# EAGLE design SpaceInvaders-v30 (EAGLE 8.0.1)
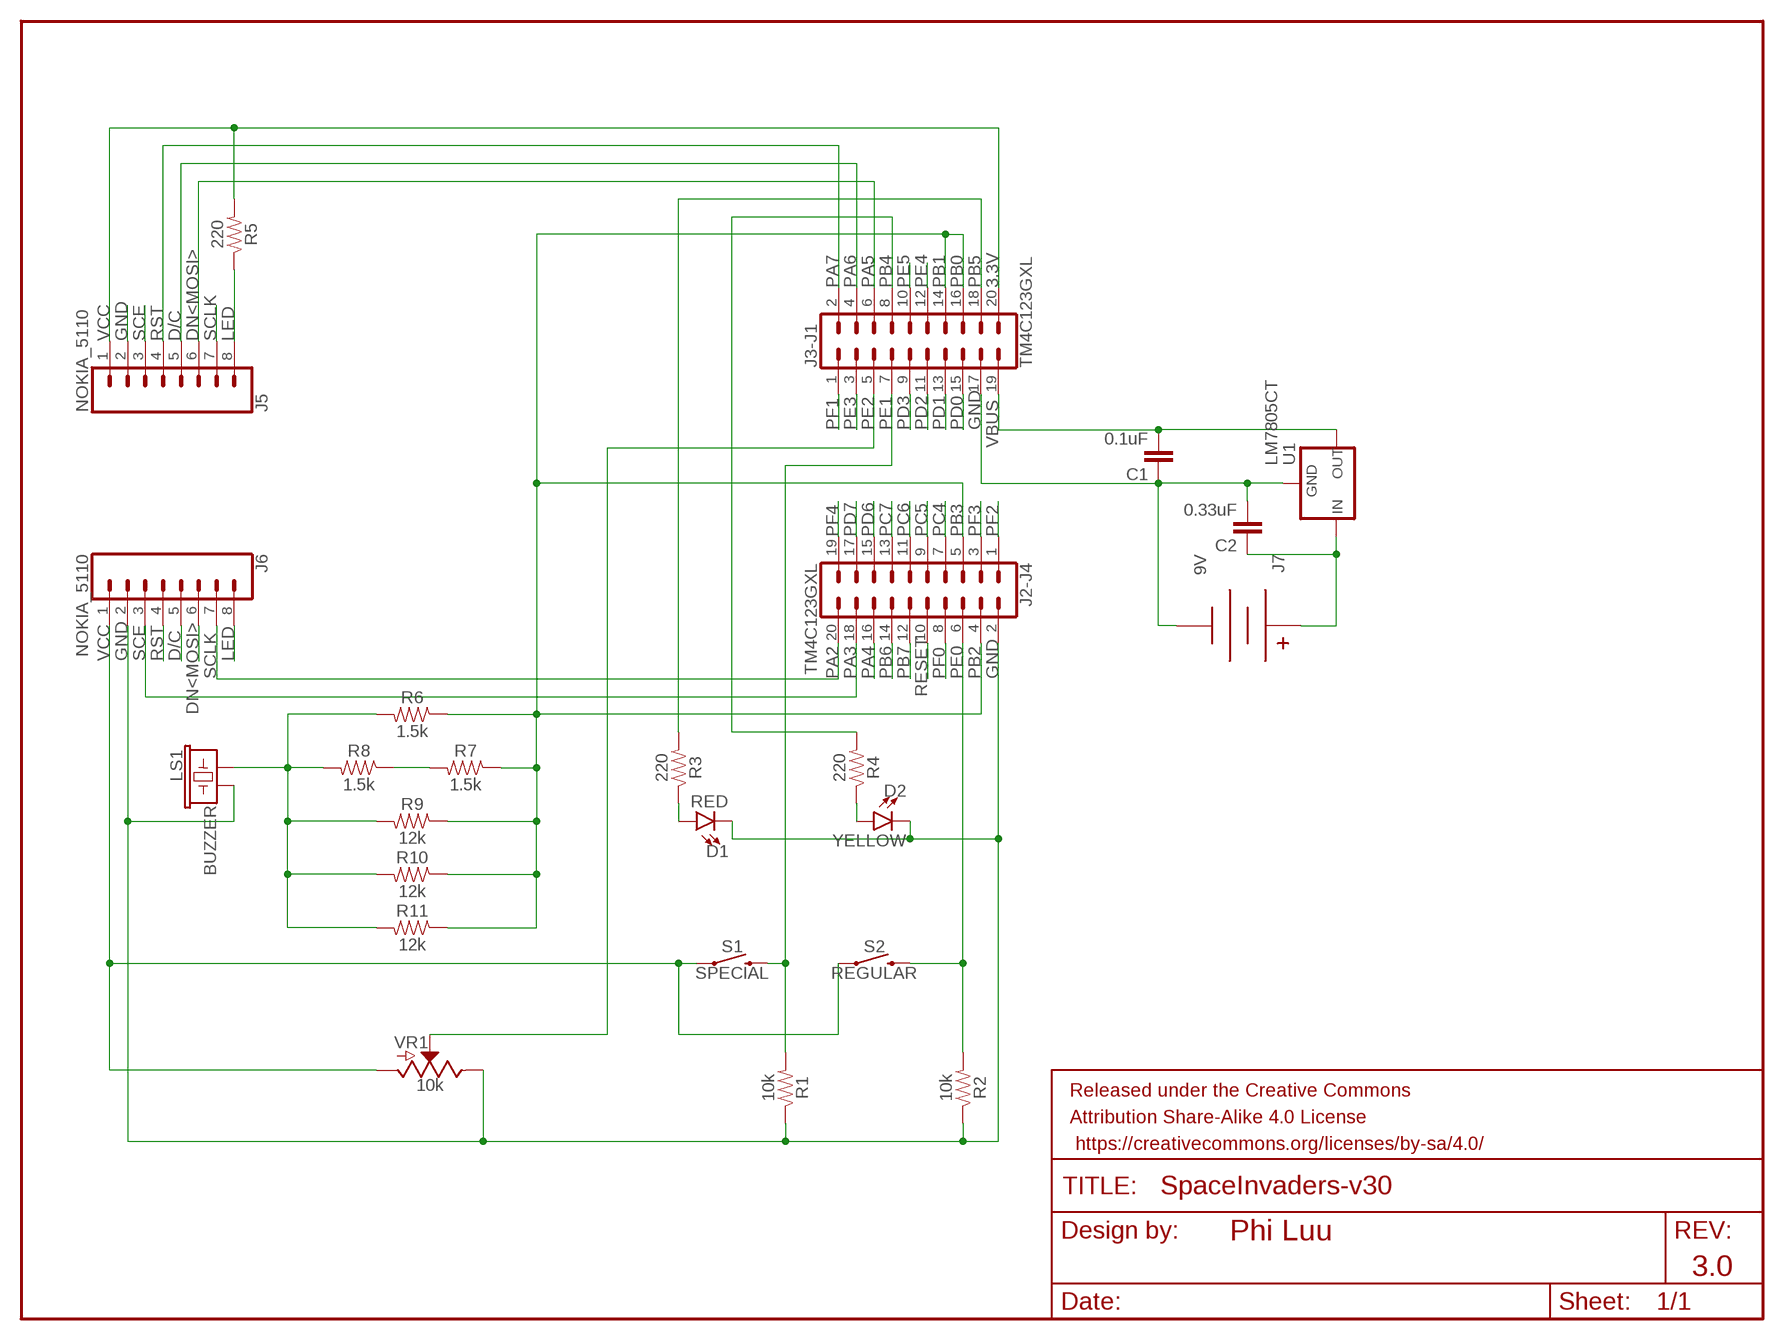
[diagram p0: schematic, sheet 1]

## Parts
C1  0.1uF  0.1UF-KIT-EZ-50V-20%  [CAP-PTH-SMALL-KIT]
C2  0.33uF  0.1UF-KIT-EZ-50V-20%  [CAP-PTH-SMALL-KIT]
D1  RED  LED5MM  [LED_5MM]
D2  YELLOW  LED5MM  [LED_5MM]
FRAME1  FRAME-LETTER  [CREATIVE_COMMONS]
J2-J4  TM4C123GXL  CONN_10X2  [2X10]
J3-J1  TM4C123GXL  CONN_10X2  [2X10]
J5  NOKIA_5110  CONN_08"  [1X08]
J6  NOKIA_5110  CONN_08"  [1X08]
J7  9V  BC9VPC  [BC9VPC]
LS1  BUZZER  BUZZER-PTH  [BUZZER-12MM]
R1  10k  10KOHM-HORIZ-1/4W-5%  [AXIAL-0.3]
R2  10k  10KOHM-HORIZ-1/4W-5%  [AXIAL-0.3]
R3  220  1KOHM-HORIZ-1/4W-5%  [AXIAL-0.3]
R4  220  1KOHM-HORIZ-1/4W-5%  [AXIAL-0.3]
R5  220  1KOHM-HORIZ-1/4W-5%  [AXIAL-0.3]
R6  1.5k  1KOHM-HORIZ-1/4W-5%  [AXIAL-0.3]
R7  1.5k  1KOHM-HORIZ-1/4W-5%  [AXIAL-0.3]
R8  1.5k  1KOHM-HORIZ-1/4W-5%  [AXIAL-0.3]
R9  12k  1KOHM-HORIZ-1/4W-5%  [AXIAL-0.3]
R10  12k  1KOHM-HORIZ-1/4W-5%  [AXIAL-0.3]
R11  12k  1KOHM-HORIZ-1/4W-5%  [AXIAL-0.3]
S1  SPECIAL  MOMENTARY-SWITCH-SPST-PTH-6.0MM  [TACTILE_SWITCH_PTH_6.0MM]
S2  REGULAR  MOMENTARY-SWITCH-SPST-PTH-6.0MM  [TACTILE_SWITCH_PTH_6.0MM]
U1  LM7805CT  V_REG_78XX-TO-220  [TO-220-ALT]
VR1  10k  POTENTIOMETER_SLIDE-30MM-1/10W-20%  [SLIDER-MEDIUM]

## Nets
3.3V [power]: J3-J1.20 J5.1 J6.1 R5.P$2 S1.1 S2.1 VR1.BOTTOM(A)
9V [power]: C2.1 J7.V+ U1.IN
DAC: J2-J4.4 J2-J4.5 J3-J1.14 J3-J1.16 R6.P$1 R7.P$1 R9.P$1 R10.P$1 R11.P$1
DAC_OUT: LS1.+ R6.P$2 R8.P$2 R9.P$2 R10.P$2 R11.P$2
GND: C1.1 C2.2 D1.K(C) D2.K(C) J2-J4.2 J3-J1.17 J5.2 J6.2 J7.V- LS1.- R1.P$1 R2.P$1 U1.GND VR1.TOP(E)
LED: J5.8 J6.8 R5.P$1
LLED: D1.A R3.P$1
N$1: R7.P$2 R8.P$1
PA2: J2-J4.20 J5.7 J6.7
PA3: J2-J4.18 J5.3 J6.3
PA4: J2-J4.16
PA5: J3-J1.6 J5.6 J6.6
PA6: J3-J1.4 J5.5 J6.5
PA7: J3-J1.2 J5.4 J6.4
PB4: J3-J1.8 R4.P$2
PB5: J3-J1.18 R3.P$2
PB6: J2-J4.14
PB7: J2-J4.12
PC4: J2-J4.7
PC5: J2-J4.9
PC6: J2-J4.11
PC7: J2-J4.13
PD0: J3-J1.15
PD1: J3-J1.13
PD2: J3-J1.11
PD3: J3-J1.9
PD6: J2-J4.15
PD7: J2-J4.17
PE0: J2-J4.6 R2.P$2 S2.3
PE1: J3-J1.7 R1.P$2 S1.3
PE2: J3-J1.5 VR1.WIPER(S)
PE3: J3-J1.3
PE4: J3-J1.12
PE5: J3-J1.10
PF0: J2-J4.8
PF1: J3-J1.1
PF2: J2-J4.1
PF3: J2-J4.3
PF4: J2-J4.19
RESET: J2-J4.10
RLED: D2.A R4.P$1
VBUS [power]: C1.2 J3-J1.19 U1.OUT

## Notes on the sheet
- PB1 | PB0
- VCC | SCE | RST | D/C | DN<MOSI> | SCLK
- PB3
- VCC | SCE | RST | D/C
- SCLK | PB2
- DN<MOSI>
- Phi Luu
- 3.0

## Library data of the parts
C1 = SparkFun-Capacitors:0.1UF: 0.1µF ceramic capacitors A capacitor is a passive two-terminal electrical component used to store electrical energy temporarily in an electric field.; PROD_ID: CAP-08370
C2 = SparkFun-Capacitors:0.1UF: 0.1µF ceramic capacitors A capacitor is a passive two-terminal electrical component used to store electrical energy temporarily in an electric field.; PROD_ID: CAP-08370; VALUE: 0.1uF
D1 D2 = SparkFun-LED:LED: LED (Generic) Standard schematic elements and footprints for 5mm, 3mm, 1206, and 0603 sized LEDs. Generic LEDs with no color specified.
FRAME1 = SparkFun-Aesthetics:FRAME-LETTER: Schematic Frame - Letter Standard 8.5x11 US Letter frame
J2-J4 J3-J1 = SparkFun-Connectors:CONN_10X2: Multi connection point. Often used as Generic Header-pin footprint for 0.1 inch spaced/style header connections On any of the 0.1 inch spaced packages, you can populate with these: Break Away Headers - Straight <https://www.sparkfun.com/products/116> (PRT-00116) Break Away Male Headers - Right Angle <https://www.sparkfun.com/products/553> (PRT-00553) Female Headers <https://www.sparkfun.com/products/115> (PRT-00115) Break Away Headers - Machine Pin <https://www.sparkfun.com/products/117> (PRT-00117) Break Away Female Headers - Swiss Machine Pin <https://www.sparkfun.com/products/743> (PRT-00743) Special note about the "SPECIAL" package: This was SPECIALLY designed to be used with our Graphic LCD Backpack. Be sure you want to use this! It is not only staggered on each line of header holes, but IT IS ALSO offset of the center point of the top and bottom lines by 5 mil. This causes the headers to lock into place on the "standard" footprint on the LCD screen. The extra squares on the tdocu layer are there simply to reference other pins (if you were to actually populate a longer header than ten long - this is what we do with the backpacks).
J5 J6 = SparkFun-Connectors:CONN_08: Multi connection point. Often used as Generic Header-pin footprint for 0.1 inch spaced/style header connections On any of the 0.1 inch spaced packages, you can populate with these: Break Away Headers - Straight <https://www.sparkfun.com/products/116> (PRT-00116) Break Away Male Headers - Right Angle <https://www.sparkfun.com/products/553> (PRT-00553) Female Headers <https://www.sparkfun.com/products/115> (PRT-00115) Break Away Headers - Machine Pin <https://www.sparkfun.com/products/117> (PRT-00117) Break Away Female Headers - Swiss Machine Pin <https://www.sparkfun.com/products/743> (PRT-00743) Arduino Stackable Header - 8 Pin <https://www.sparkfun.com/products/9279> (PRT-09279) For SCREWTERMINALS and SPRING TERMINALS visit here: Screw Terimnals on SparkFun.com <https://www.sparkfun.com/search/results?term=Screw+Terminals> (5mm/3.5mm/2.54mm spacing) This device is also useful as a general connection point to wire up your design to another part of your project. Our various solder wires solder well into these plated through hole pads. Hook-Up Wire - Assortment (Stranded, 22 AWG) <https://www.sparkfun.com/products/11375> (PRT-11375) Hook-Up Wire - Assortment (Solid Core, 22 AWG) <https://www.sparkfun.com/products/11367> (PRT-11367) View the entire wire category on our website here <https://www.sparkfun.com/categories/141> Special notes: Molex polarized connector foot print use with SKU : PRT-08231 with associated crimp pins and housings. 1MM SMD Version SKU: PRT-10208 NOTES ON THE VARIANTS LOCK and LOCK_LONGPADS... This footprint was designed to help hold the alignment of a through-hole component (i.e. 6-pin header) while soldering it into place. You may notice that each hole has been shifted either up or down by 0.005 of an inch from it's more standard position (which is a perfectly straight line). This slight alteration caused the pins (the squares in the middle) to touch the edges of the holes. Because they are alternating, it causes a "brace" to hold the component in place. 0.005 has proven to be the perfect amount of "off-center" position when using our standard breakaway headers. Although looks a little odd when you look at the bare footprint, once you have a header in there, the alteration is very hard to notice. Also,if you push a header all the way into place, it is covered up entirely on the bottom side.; PROD_ID: CONN-08438
J7 = SparkFun-Connectors:BC9VPC: 9V Battery Holder - PC Mount Standard and Kit footprints included SparkFun Products: SparkFun SparkPunk Sound Kit <https://www.sparkfun.com/products/11177> SparkFun SparkPunk Sequencer Kit <https://www.sparkfun.com/products/12707>; PROD_ID: BATT-10855
LS1 = SparkFun-Electromechanical:BUZZER: Buzzer Small round buzzers that operate around the audible 2kHz range. You can use these as speakers to create simple music or user interfaces. Variant Overview: PTH - Mini Speaker - PC Mount 12mm 2.048kHz <https://www.sparkfun.com/products/7950> PTH_KIT - Mini Speaker - PC Mount 12mm 2.048kHz <https://www.sparkfun.com/products/7950> KIT simplifies soldering by adding stop mask to one side of the pads. PTH_NO_SILK - Mini Speaker - PC Mount 12mm 2.048kHz <https://www.sparkfun.com/products/7950> No silkscreen indicator of buzzer outline. PTH_KIT_NO_SILK - Mini Speaker - PC Mount 12mm 2.048kHz <https://www.sparkfun.com/products/7950> KIT package w/o silkscreen SMD - Buzzer Audio Magnetic (CCV-084B16) SMD buzzer used on, e.g. the LilyPad Buzzer <https://www.sparkfun.com/products/8463> and RFID USB Reader <https://www.sparkfun.com/products/9963>. SMD_KIT - Buzzer Audio Magnetic (CCV-084B16) SMD Buzzer with elongated pins to make soldering easier. Used on the SparkFun Simon Says - Surface Mount Soldering Kit <https://www.sparkfun.com/products/10935>.; PROD_ID: COMP-08253; SF_SKU: COM-07950
R1 R2 = SparkFun-Resistors:10KOHM: 10kΩ resistor A resistor is a passive two-terminal electrical component that implements electrical resistance as a circuit element. Resistors act to reduce current flow, and, at the same time, act to lower voltage levels within circuits. - Wikipedia; PROD_ID: RES-09435
R3-R11 = SparkFun-Resistors:1KOHM: 1kΩ resistor A resistor is a passive two-terminal electrical component that implements electrical resistance as a circuit element. Resistors act to reduce current flow, and, at the same time, act to lower voltage levels within circuits. - Wikipedia; PROD_ID: RES-08380; VALUE: 1k
S1 S2 = SparkFun-Switches:MOMENTARY-SWITCH-SPST: Momentary Switch (Pushbutton) - SPST Normally-open (NO) SPST momentary switches (buttons, pushbuttons). Variants PTH-12MM - 12mm square, through-hole Momentary Pushbutton Switch - 12mm Square <https://www.sparkfun.com/products/9190> (COM-09190) PTH-6.0MM, PTH-6.0MM-KIT - 6.0mm square, through-hole Mini Pushbutton Switch <https://www.sparkfun.com/products/97> (COM-00097) KIT package intended for soldering kit's - only one side of pads' copper is exposed. PTH-RIGHT-ANGLE-KIT - Right-angle, through-hole Right Angle Tactile Button <https://www.sparkfun.com/products/10791> - Used on SparkFun BigTime Watch Kit <https://www.sparkfun.com/products/11734> SMD-12MM - 12mm square, surface-mount Tactile Button - SMD (12mm) <https://www.sparkfun.com/products/12993> (COM-12993) Used on SparkFun PicoBoard <https://www.sparkfun.com/products/11888> SMD-4.5MM - 4.5mm Square Trackball Switch Used on SparkFun Blackberry Trackballer Breakout <https://www.sparkfun.com/products/13169> SMD-4.6MMX2.8MM - 4.60mm x 2.80mm, surface mount Used on SparkFun SAMD21 Mini Breakout <https://www.sparkfun.com/products/13664> SMD-5.2MM, SMD-5.2-REDUNDANT - 5.2mm square, surface-mount Mini Pushbutton Switch - SMD <https://www.sparkfun.com/products/8720> (COM-08720) Used on Arduino Pro Mini <https://www.sparkfun.com/products/11114> REDUNDANT package connects both switch circuits together SMD-6.0X3.5MM - 6.0 x 3.5mm, surface mount Momentary Reset Switch SMD <https://www.sparkfun.com/products/8229> (COM-08229) SMD-6.2MM-TALL - 6.2mm square, surface mount Tactile Button - SMD (6mm) <https://www.sparkfun.com/products/12992> Used on SparkFun Digital Sandbox <https://www.sparkfun.com/products/12651> SMD-RIGHT-ANGLE - Right-angle, surface mount Used on SparkFun Block for Intel® Edison - Arduino <https://www.sparkfun.com/products/13036>; PROD_ID: SWCH-08441; SF_SKU: COM-00097
U1 = SparkFun-IC-Power:V_REG_78XX: Voltage Regulator Standard 78xx regulator. IGO (Input Ground Output). Spark Fun Electronics SKU : COM-00107; PROD_ID: VREG-08450; SF_ID: COM-00107
VR1 = SparkFun-Resistors:POTENTIOMETER_SLIDE: Slide Potentiometer Slide-type potentiometers - pots that are adjusted by sliding a wiper up or down. Commonly found en-masse on sound boards. Variants 60MM - Slide Pot - X-Large (10k Linear Taper) <https://www.sparkfun.com/products/9119> (COM-09119) 10k linear slide pot with 60mm travel. Datasheet <http://cdn.sparkfun.com/datasheets/Components/Switches/SC608N-b10k.pdf> 30MM, 30MM-KIT - Slide Pot - Medium (10k Linear Taper) <https://www.sparkfun.com/products/11621> (COM-11621) 10k linear slide pot with 30mm travel. Datasheet <http://cdn.sparkfun.com/datasheets/Components/Switches/C-31-.pdf> (C3031N-1A2-B10K-GP) "KIT" variant, intended for soldering kits, has tStop removed from pads so the component can only be stuffed on one side of the board. 20MM - Slide Pot - Small (10k Linear Taper) <https://www.sparkfun.com/products/11620> (COM-11620) 10k linear slide pot with 20mm travel. Datasheet <http://cdn.sparkfun.com/datasheets/Components/Switches/C-31-.pdf> (C2031N-1A2-B10K-GP); PROD_ID: RES-11931; SF_SKU: COM-11621

## Net classes
0 default: width 0.254 mm, drill 0.508 mm, clearance 0.254 mm
1 power: width 0.305 mm, drill 0.508 mm, clearance 0.254 mm

## Board
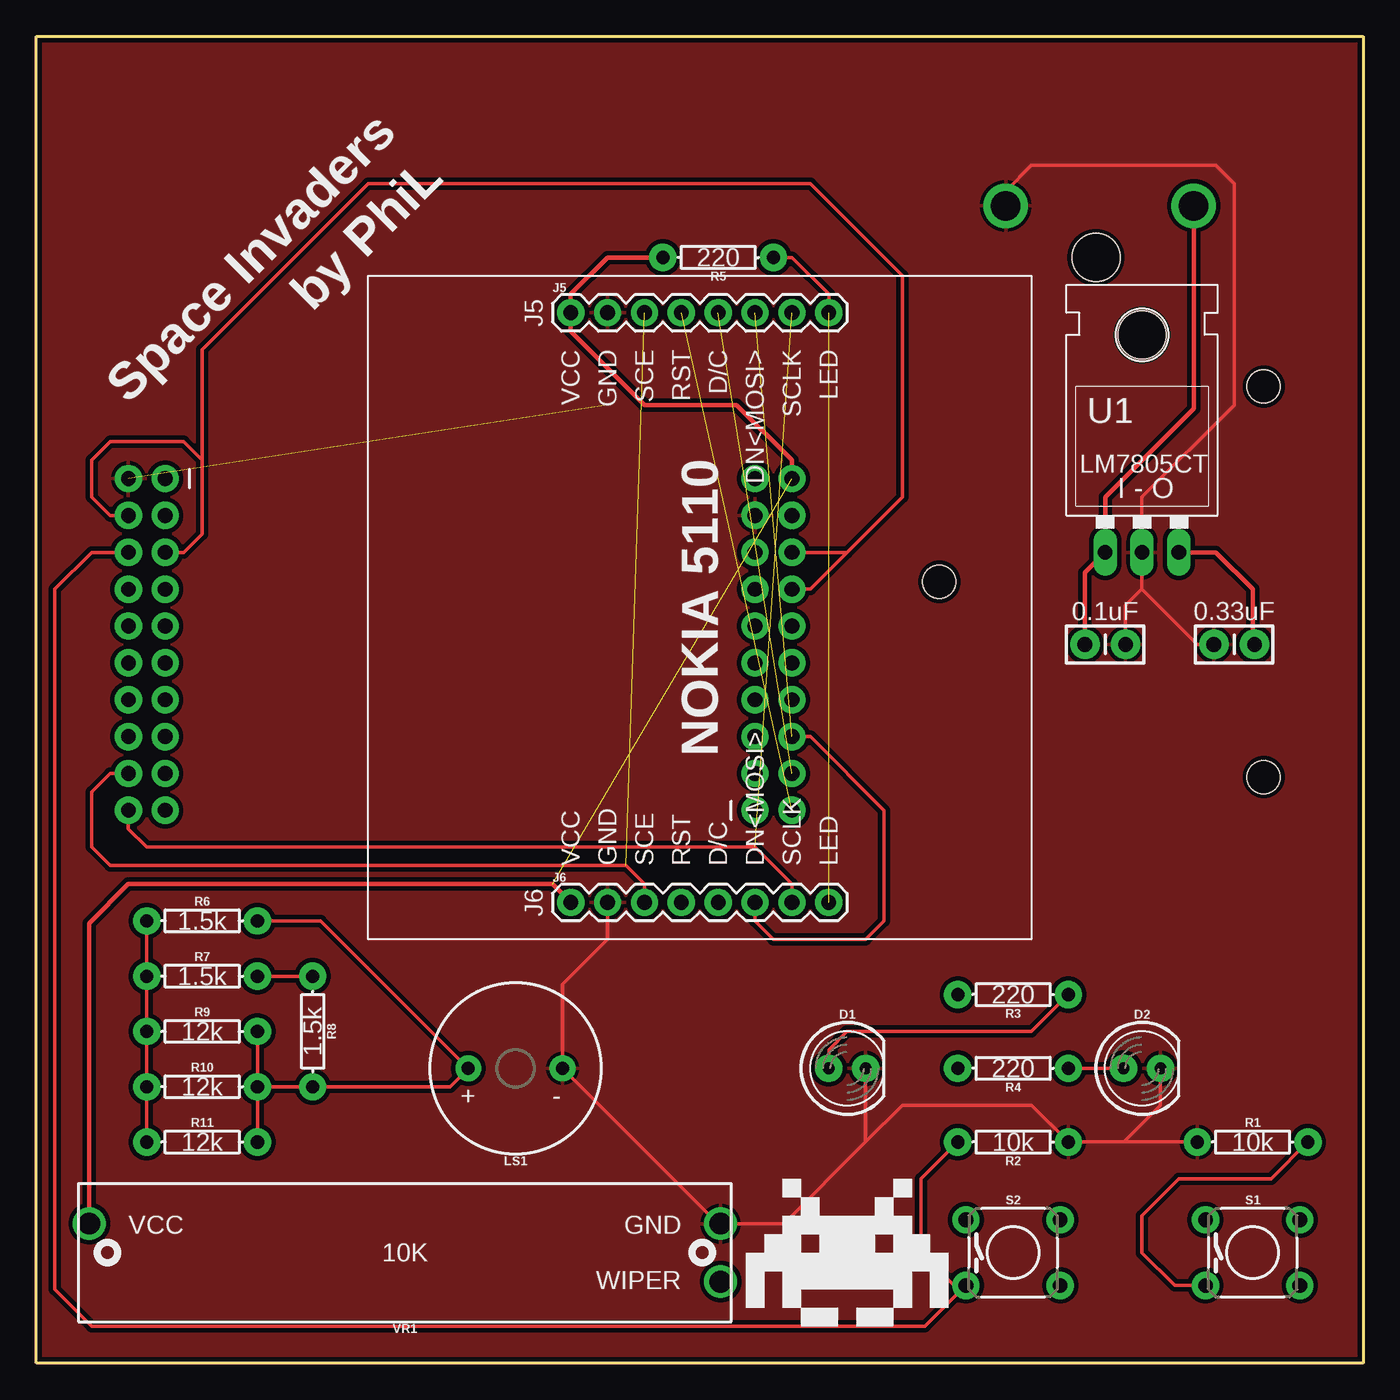
[diagram p1: board, top side]
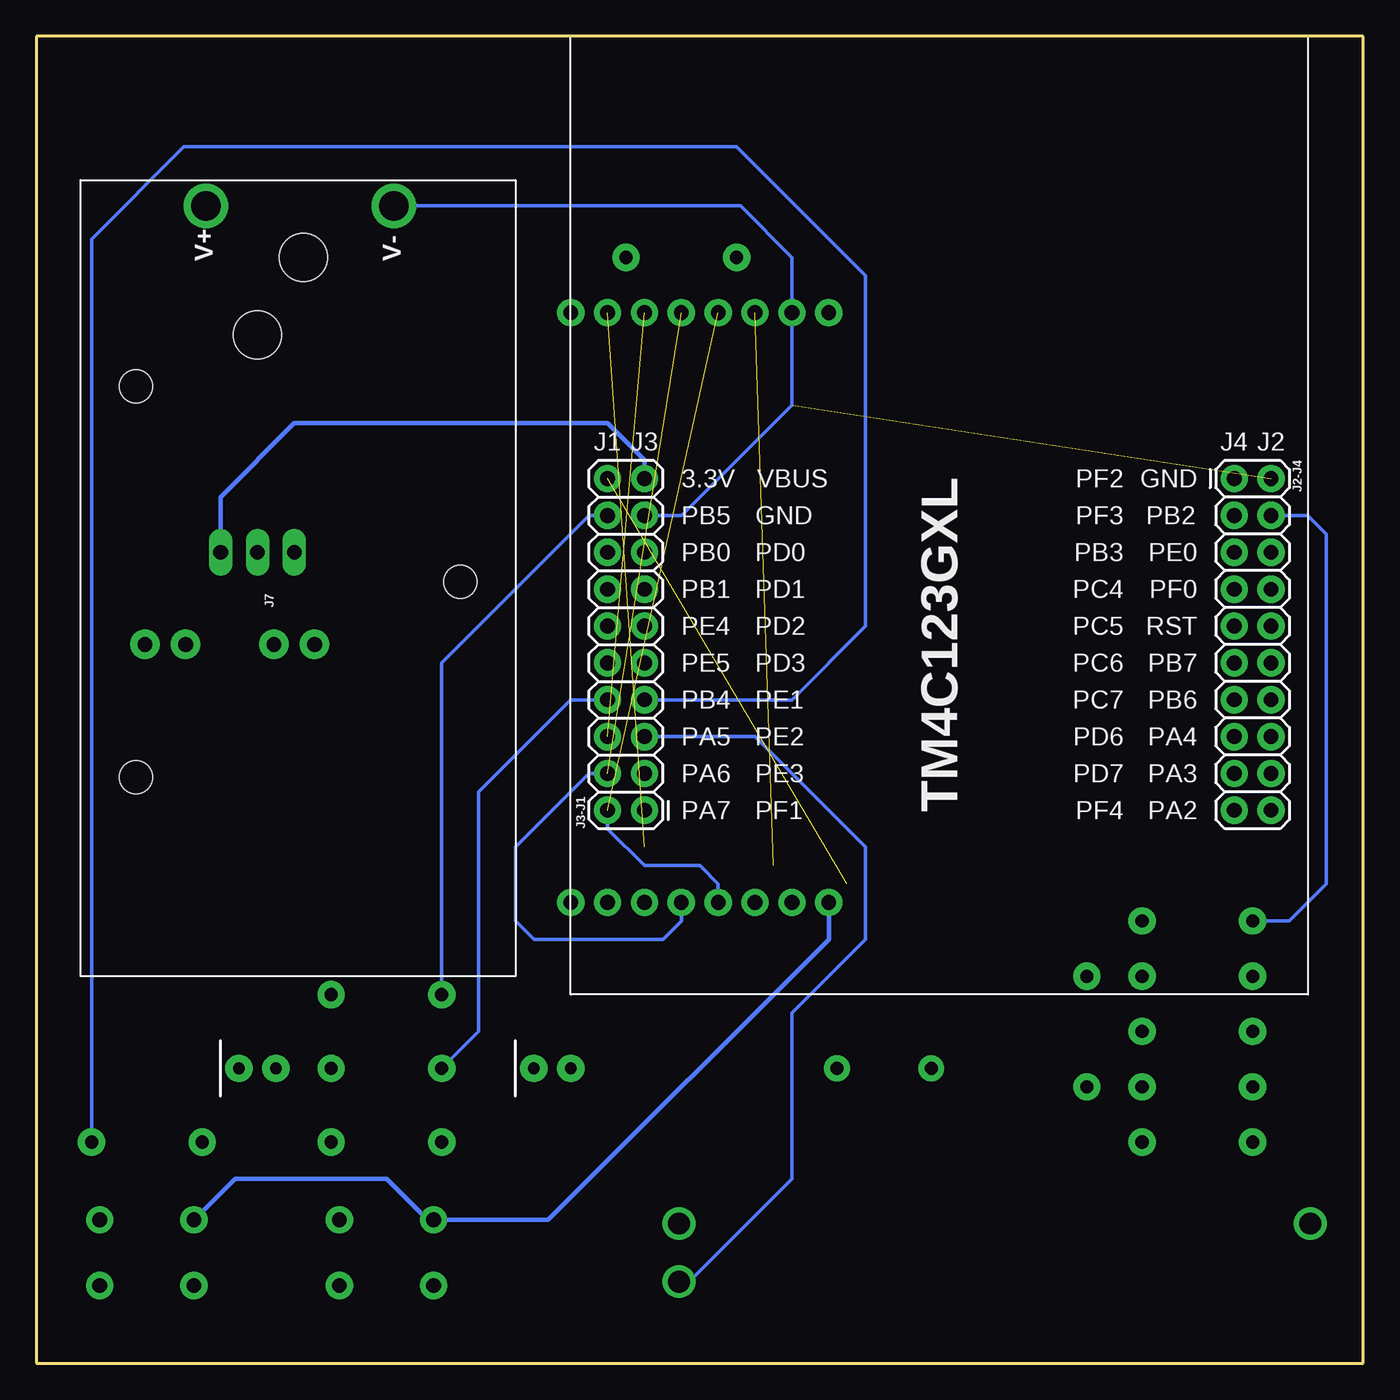
[diagram p2: board, bottom side, seen from below]

Size 91.44 x 91.44 mm. Coordinates in mm from the lower left corner, seen from the top.
Outline: 0,0 0,91.44 91.44,91.44 91.44,0 0,0
Copper layers (1*16): Top 0.035mm / dielectric 1.5mm / Bottom 0.035mm
Design rules "SparkFun": minimum track width 8mil, minimum drill 20mil, track to track 8mil, track to pad 8mil, pad to pad 8mil, via to via 8mil, smd to smd 8mil, copper to edge 10mil, drill to drill 8mil, minimum pad ring 12mil, minimum via ring 10mil, stop-mask expansion 4mil, vias tented up to drill 25mil, thermal gap 10mil
Holes 3.3 mm at 73.03,76.2

### Footprints (pad centres in the part's own frame; a part is rotated, then mirrored left to right if it is on the bottom)
CAP-PTH-SMALL-KIT = drill 1.016 pad 2.032: 1 -1.397,0; 2 1.397,0
LED_5MM = drill 0.813 pad 1.88: A -1.27,0; K 1.27,0
2X10 = drill 1.016 pad 1.88: 1 0,0; 2 0,2.54; 3 2.54,0; 4 2.54,2.54; 5 5.08,0; 6 5.08,2.54; 7 7.62,0; 8 7.62,2.54; 9 10.16,0; 10 10.16,2.54; 11 12.7,0; 12 12.7,2.54; 13 15.24,0; 14 15.24,2.54; 15 17.78,0; 16 17.78,2.54; 17 20.32,0; 18 20.32,2.54; 19 22.86,0; 20 22.86,2.54
1X08 = drill 1.016 pad 1.88: 1 0,0; 2 2.54,0; 3 5.08,0; 4 7.62,0; 5 10.16,0; 6 12.7,0; 7 15.24,0; 8 17.78,0
BC9VPC = drill 2.032: V+ 53.086,21.336; V- 53.086,8.382 | hole 2.286: 27.178,3.81; 13.716,26.162; 40.64,26.162
BUZZER-12MM = drill 0.9 pad 1.778: + 3.25,0; - -3.25,0
AXIAL-0.3 = drill 0.9 pad 1.88: P$1 -3.81,0; P$2 3.81,0
TACTILE_SWITCH_PTH_6.0MM = drill 1.016 pad 1.88: 1 -3.251,2.261; 2 3.251,2.261; 3 -3.251,-2.261; 4 3.251,-2.261
TO-220-ALT = drill 1.016 long: GND 0,-3.81; IN -2.54,-3.81; OUT 2.54,-3.81 | hole 3.302: 0,11.176
SLIDER-MEDIUM = drill 1.5: BOTTOM 21.75,-2; TOP -21.75,-2; WIPER -21.75,2

### Placement (x,y rotation side)
C1  82.55,49.53 0 top
C2  73.66,49.53 0 top
D1  55.88,20.32 0 top
D2  76.2,20.32 0 top
FRAME1  12.7,-7.62 0 top  (outside the outline)
J2-J4  8.89,60.96 270 bottom
J3-J1  49.53,38.1 90 bottom
J5  36.83,72.39 0 top
J6  36.83,31.75 0 top
J7  58.42,26.67 90 bottom
LS1  33.02,20.32 180 top
R1  83.82,15.24 0 top
R2  67.31,15.24 180 top
R3  67.31,25.4 180 top
R4  67.31,20.32 180 top
R5  46.99,76.2 180 top
R6  11.43,30.48 0 top
R7  11.43,26.67 0 top
R8  19.05,22.86 270 top
R9  11.43,22.86 0 top
R10  11.43,19.05 0 top
R11  11.43,15.24 0 top
S1  83.82,7.62 0 top
S2  67.31,7.62 0 top
U1  76.2,59.69 0 top
VR1  25.4,7.62 180 top

### Tracks (layer width: path | path; a pad name or v marks a point on that pad's centre or on a via)
3.3V  (1 unrouted)
  Top 0.305: VR1.BOTTOM 3.65,30.32 6.35,33.02 35.56,33.02 J6.1 | R5.P$2 39.37,76.2 36.83,73.66 J5.1 36.83,71.12 41.91,66.04 48.26,66.04 52.07,62.23 J3-J1.20
  Bottom 0.305: S1.1 77.75,12.7 67.31,12.7 64.49,9.88 S2.1 56.16,9.88 36.83,29.21 J6.1
9V
  Top 0.305: J7.V+ 79.76,65.79 73.66,59.69 U1.IN 72.26,54.48 C2.1
DAC
  Top 0.254: R6.P$1 R7.P$1 R9.P$1 R10.P$1 R11.P$1 | J2-J4.5 10.16,55.88 11.43,57.15 11.43,62.23 | 11.43,62.23 11.43,69.85 22.86,81.28 53.34,81.28 59.69,74.93 59.69,59.69 55.88,55.88 | 55.88,55.88 J3-J1.16 | J3-J1.14 53.34,53.34 55.88,55.88 | J2-J4.4 5.08,58.42 3.81,59.69 3.81,62.23 5.08,63.5 10.16,63.5 11.43,62.23
  Bottom 0.254: J2-J4.4 3.81,58.42 2.54,57.15 2.54,33.02 5.08,30.48 R6.P$1
DAC_OUT
  Top 0.254: R6.P$2 19.61,30.48 LS1.+ 28.5,19.05 R8.P$2 R10.P$2 | R9.P$2 R10.P$2 | R10.P$2 R11.P$2
GND  (1 unrouted)
  Top 0.254: J7.V- 66.8,80.77 68.58,82.55 81.28,82.55 82.55,81.28 82.55,66.04 76.2,59.69 U1.GND 76.2,53.34 | C1.1 80.01,49.53 76.2,53.34 | C2.2 75.06,52.2 76.2,53.34 | 74.93,15.24 R2.P$1 68.58,17.78 59.69,17.78 57.15,15.24 | 74.93,15.24 R1.P$1 | D2.K 77.47,17.78 74.93,15.24 | 57.15,15.24 51.53,9.62 VR1.TOP 46.97,9.62 LS1.- 36.27,26.11 39.37,29.21 J6.2 | 57.15,15.24 D1.K
  Bottom 0.254: J7.V- 42.93,79.76 39.37,76.2 J5.2 39.37,66.04 46.99,58.42 J3-J1.17
  pour Top (isolate 0.305): 0,0 0,91.44 91.44,91.44 91.44,0
LED  (1 unrouted)
  Top 0.254: R5.P$1 52.07,76.2 54.61,73.66 J5.8
LLED
  Top 0.254: D1.A 54.61,21.59 55.88,22.86 68.58,22.86 R3.P$1
N$1
  Top 0.254: R7.P$2 R8.P$1
PA2  (1 unrouted)
  Top 0.254: J2-J4.20 6.35,36.83 7.62,35.56 49.53,35.56 52.07,33.02 J6.7
PA3  (1 unrouted)
  Top 0.254: J2-J4.18 5.08,40.64 3.81,39.37 3.81,35.56 5.08,34.29 40.64,34.29 41.91,33.02 J6.3
PA5  (1 unrouted)
  Top 0.254: J3-J1.6 53.34,43.18 58.42,38.1 58.42,30.48 57.15,29.21 50.8,29.21 49.53,30.48 J6.6
PA6  (1 unrouted)
  Bottom 0.254: J3-J1.4 53.34,40.64 58.42,35.56 58.42,30.48 57.15,29.21 48.26,29.21 46.99,30.48 J6.5
PA7  (1 unrouted)
  Bottom 0.254: J6.4 44.45,33.02 45.72,34.29 49.53,34.29 52.07,36.83 J3-J1.2
PB4
  Bottom 0.254: R4.P$2 60.96,22.86 60.96,39.37 54.61,45.72 J3-J1.8
PB5
  Bottom 0.254: R3.P$2 63.5,48.26 53.34,58.42 J3-J1.18
PE0
  Top 0.254: R2.P$2 60.96,12.7 60.96,7.62 63.22,5.36 S2.3 61.24,2.54 3.81,2.54 1.27,5.08 1.27,53.34 3.81,55.88 J2-J4.6
PE1
  Top 0.254: S1.3 78.46,5.36 76.2,7.62 76.2,10.16 78.74,12.7 85.09,12.7 R1.P$2
  Bottom 0.254: R1.P$2 87.63,77.47 81.28,83.82 43.18,83.82 34.29,74.93 34.29,50.8 39.37,45.72 J3-J1.7
PE2
  Bottom 0.254: VR1.WIPER 46.45,5.62 39.37,12.7 39.37,24.13 34.29,29.21 34.29,35.56 41.91,43.18 J3-J1.5
RLED
  Top 0.254: D2.A R4.P$1
VBUS
  Top 0.305: U1.OUT 81.28,55.88 83.82,53.34 83.82,49.66 C1.2
  Bottom 0.305: U1.OUT 78.74,59.69 73.66,64.77 52.07,64.77 49.53,62.23 J3-J1.19

### Text on the board
tPlace: 220 | by PhiL | J5 | VCC | GND | SCE | RST | D/C | DN<MOSI> | SCLK | LED | Space Invaders | LM7805CT | I - O | NOKIA 5110 | 0.1uF | 0.33uF | VCC | GND | SCE | RST | D/C | DN<MOSI> | SCLK | LED | J6 | 1.5k | 1.5k | 220 | 12k | 1.5k | 220 | 12k | + | - | 12k | 10k | 10k | VCC | GND | 10K | WIPER
bPlace: J2 | J4 | J3 | J1 | GND | PF2 | VBUS | 3.3V | PB2 | PF3 | GND | PB5 | PE0 | PB3 | PD0 | PB0 | PF0 | PC4 | PD1 | PB1 | RST | PC5 | PD2 | PE4 | TM4C123GXL | PB7 | PC6 | PD3 | PE5 | PB6 | PC7 | PE1 | PB4 | PA4 | PD6 | PE2 | PA5 | PA3 | PD7 | PE3 | PA6 | PA2 | PF4 | PF1 | PA7
tDocu: Phi Luu